# Altium project bailey-x.PrjPcb (part 2 of 8)
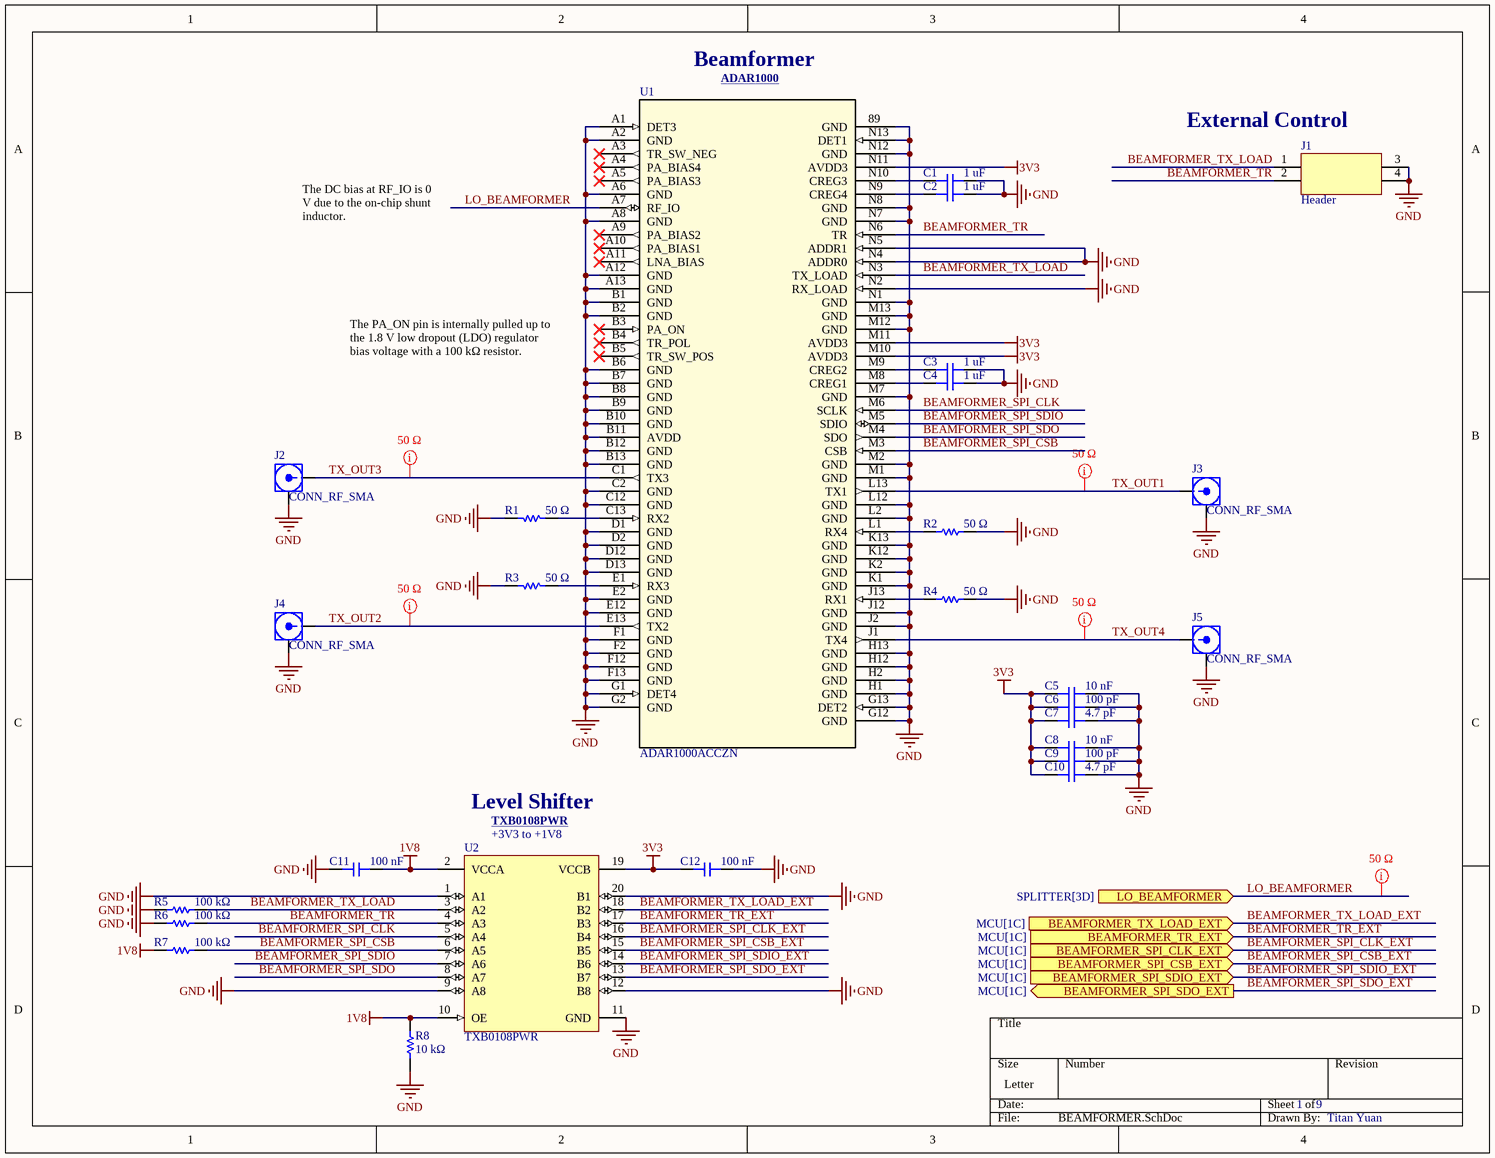
[diagram p9: BEAMFORMER.SchDoc]

## Sheet BEAMFORMER.SchDoc (continued)
### Library data of the parts
C1-C4 = CAP: 25V 1uF X7R ±10% 0603 Multilayer Ceramic Capacitors MLCC - SMD/SMT ROHS; Manufacturer: Samsung Electro-Mechanics; Manufacturer Part Number: CL10B105KA8NNNC; Tolerance: +-10%; Value: 1µF; Voltage Rating: 25 V; Dielectric: Ceramic; Package Size: 0603; Supplier: DigiKey; Supplier Part Number: 1276-1184-1-ND; RoHS: Compliant; Category: Ceramic Capacitors; Stock: 1060664; Pricing: 1=0.1, 10=0.036, 50=0.0244, 100=0.0208, 500=0.01486, 1000=0.01305 (USD); Case/Package: 0603; Case Code (Imperial): 0603; Case Code (Metric): 1608; China RoHS: Compliant; Contact Plating: Tin; Country of Origin: Mainland China, Philippines, South Korea; Depth: 800µm; Dielectric Material: Ceramic; Export Control Classification Number (ECCN) Code: EAR99; Height: 900µm; Harmonized Tariff Schedule (HTS) Code: 8532.24.00.20; Introduction Date: 2009-11-02; Length: 1.6mm; Lifecycle Status: Production; Material: Ceramic; Max Operating Temperature: 125°C; Min Operating Temperature: -55°C; Mounting Technology: Surface Mount; Number of Terminals: 2; Radiation Hardening: No; REACH SVHC: Yes; Schedule B: 8532240020, 8532240020|8532240020, 8532240020|8532240020|8532240020, 8532240020|8532240020|8532240020|8532240020; Thickness: 889µm; Voltage: 25V; Voltage Rating (DC): 25V; Width: 800µm; ComponentLink1URL: https://datasheet.octopart.com:443/CL10B105KA8NNNC-Samsung-Electro-Mechanics-datasheet-182019882.pdf?src-supplier=IHS; ComponentLink1Description: https://datasheet.octopart.com:443/CL10B105KA8NNNC-Samsung-Electro-Mechanics-datasheet-182019882.pdf?src-supplier=IHS; ComponentLink2URL: https://datasheet.octopart.com:443/CL10B105KA8NNNC-Samsung-Electro-Mechanics-datasheet-106547815.pdf?src-supplier=Upverter; ComponentLink2Description: https://datasheet.octopart.com:443/CL10B105KA8NNNC-Samsung-Electro-Mechanics-datasheet-106547815.pdf?src-supplier=Upverter; ComponentLink3URL: https://datasheet.octopart.com:443/CL10B105KA8NNNC-Samsung-Electro-Mechanics-datasheet-137699931.pdf?src-supplier=Samsung+SCT; ComponentLink3Description: https://datasheet.octopart.com:443/CL10B105KA8NNNC-Samsung-Electro-Mechanics-datasheet-137699931.pdf?src-supplier=Samsung+SCT; ComponentLink4URL: https://datasheet.octopart.com:443/CL10B105KA8NNNC-Samsung-Electro-Mechanics-datasheet-116890983.pdf?src-supplier=Future+Electronics; ComponentLink4Description: https://datasheet.octopart.com:443/CL10B105KA8NNNC-Samsung-Electro-Mechanics-datasheet-116890983.pdf?src-supplier=Future+Electronics; ComponentLink5URL: https://datasheet.octopart.com:443/CL10B105KA8NNNC-Samsung-datasheet-12527851.pdf?src-supplier=Future+Electronics; ComponentLink5Description: https://datasheet.octopart.com:443/CL10B105KA8NNNC-Samsung-datasheet-12527851.pdf?src-supplier=Future+Electronics; ComponentLink6URL: https://datasheet.octopart.com:443/CL10B105KA8NNNC-Samsung-datasheet-26669022.pdf?src-supplier=Future+Electronics; ComponentLink6Description: https://datasheet.octopart.com:443/CL10B105KA8NNNC-Samsung-datasheet-26669022.pdf?src-supplier=Future+Electronics; ComponentLink7URL: https://datasheet.octopart.com:443/CL10B105KA8NNNC-Samsung-Electro-Mechanics-datasheet-149136795.pdf?src-supplier=Future+Electronics; ComponentLink7Description: https://datasheet.octopart.com:443/CL10B105KA8NNNC-Samsung-Electro-Mechanics-datasheet-149136795.pdf?src-supplier=Future+Electronics; ComponentLink8URL: https://datasheet.octopart.com:443/CL10B105KA8NNNC-Samsung-datasheet-37081328.pdf?src-supplier=Future+Electronics; ComponentLink8Description: https://datasheet.octopart.com:443/CL10B105KA8NNNC-Samsung-datasheet-37081328.pdf?src-supplier=Future+Electronics; ComponentLink9URL: https://datasheet.octopart.com/CL10B105KA8NNNC-Samsung-Electro-Mechanics-datasheet-97040617.pdf; ComponentLink9Description: https://datasheet.octopart.com/CL10B105KA8NNNC-Samsung-Electro-Mechanics-datasheet-97040617.pdf; ComponentLink10URL: https://datasheet.octopart.com/CL10B105KA8NNNC-Samsung-Electro-Mechanics-datasheet-8324245.pdf; ComponentLink10Description: https://datasheet.octopart.com/CL10B105KA8NNNC-Samsung-Electro-Mechanics-datasheet-8324245.pdf; ComponentLink11URL: https://datasheet.octopart.com:443/CL10B105KA8NNNC-Samsung-datasheet-59220082.pdf?src-supplier=TME; ComponentLink11Description: https://datasheet.octopart.com:443/CL10B105KA8NNNC-Samsung-datasheet-59220082.pdf?src-supplier=TME; ComponentLink12URL: https://datasheet.octopart.com:443/CL10B105KA8NNNC-Samsung-Electro-Mechanics-datasheet-11897796.pdf?src-supplier=Arrow+Electronics; ComponentLink12Description: https://datasheet.octopart.com:443/CL10B105KA8NNNC-Samsung-Electro-Mechanics-datasheet-11897796.pdf?src-supplier=Arrow+Electronics
C5 C8 = CAP: Multilayer Ceramic Capacitor, 0.01 uF, 25 V, ± 10%, X7R, 0402 [1005 Metric]; Manufacturer: Murata Electronics; Manufacturer Part Number: GRM155R71E103KA01D; Manufacturer Lifecycle Status: NRND; Tolerance: +-10%; Voltage Rating: 25 V; Value: 10nF; Insulation Resistance: 10GΩ; Voltage: 25V; Dielectric: Ceramic; Package Size: 0402; Supplier: DigiKey; Supplier Part Number: 490-1312-1-ND; RoHS: Compliant; Category: Ceramic Capacitors; Stock: 5215934; Pricing: 1=0.1, 10=0.021, 50=0.014, 100=0.0118, 500=0.00822, 1000=0.00713, 2500=0.00598, 5000=0.00529, 10000=0.0046, 20000=0.00415, 30000=0.00392, 50000=0.00367, 70000=0.00353, 100000=0.00339 (USD); Case/Package: 0402; Case Code (Imperial): 0402; Case Code (Metric): 1005; Country of Origin: Japan, Mainland China, Philippines, Singapore, Thailand; Depth: 500µm; Dielectric Material: Ceramic; Export Control Classification Number (ECCN) Code: EAR99; Height: 500µm; Harmonized Tariff Schedule (HTS) Code: 8532.24.00.20; Introduction Date: 2004-11-19; Lead Free: Lead Free; Length: 1mm; Lifecycle Status: NRND; Material: Ceramic; Max Operating Temperature: 125°C; Min Operating Temperature: -55°C; Mounting Technology: Surface Mount; Pins: 2; Number of Terminals: 2; Radiation Hardening: No; REACH SVHC: Yes; Schedule B: 8532240020, 8532240020|8532240020, 8532240020|8532240020|8532240020, 8532240020|8532240020|8532240020|8532240020; Termination: SMD/SMT; Thickness: 500µm; Voltage Rating (DC): 25V; Width: 500µm; ComponentLink1URL: https://datasheet.octopart.com:443/GRM155R71E103KA01D-Murata-datasheet-501912.pdf?src-supplier=Upverter; ComponentLink1Description: https://datasheet.octopart.com:443/GRM155R71E103KA01D-Murata-datasheet-501912.pdf?src-supplier=Upverter; ComponentLink2URL: https://datasheet.octopart.com:443/GRM155R71E103KA01D-Murata-datasheet-8326352.pdf?src-supplier=element14+APAC; ComponentLink2Description: https://datasheet.octopart.com:443/GRM155R71E103KA01D-Murata-datasheet-8326352.pdf?src-supplier=element14+APAC; ComponentLink3URL: https://datasheet.octopart.com:443/GRM155R71E103KA01D-Murata-datasheet-62320227.pdf?src-supplier=element14+APAC; ComponentLink3Description: https://datasheet.octopart.com:443/GRM155R71E103KA01D-Murata-datasheet-62320227.pdf?src-supplier=element14+APAC; ComponentLink4URL: https://datasheet.octopart.com:443/GRM155R71E103KA01D-Murata-datasheet-12548432.pdf?src-supplier=_legacy+Avnet; ComponentLink4Description: https://datasheet.octopart.com:443/GRM155R71E103KA01D-Murata-datasheet-12548432.pdf?src-supplier=_legacy+Avnet; ComponentLink5URL: https://datasheet.octopart.com:443/GRM155R71E103KA01D-Murata-datasheet-14396901.pdf?src-supplier=Future+Electronics; ComponentLink5Description: https://datasheet.octopart.com:443/GRM155R71E103KA01D-Murata-datasheet-14396901.pdf?src-supplier=Future+Electronics; ComponentLink6URL: https://datasheet.octopart.com:443/GRM155R71E103KA01D-Murata-datasheet-22122223.pdf?src-supplier=Future+Electronics; ComponentLink6Description: https://datasheet.octopart.com:443/GRM155R71E103KA01D-Murata-datasheet-22122223.pdf?src-supplier=Future+Electronics; ComponentLink7URL: https://datasheet.octopart.com:443/GRM155R71E103KA01D-Murata-datasheet-44106405.pdf?src-supplier=Future+Electronics; ComponentLink7Description: https://datasheet.octopart.com:443/GRM155R71E103KA01D-Murata-datasheet-44106405.pdf?src-supplier=Future+Electronics; ComponentLink8URL: https://datasheet.octopart.com:443/GRM155R71E103KA01D-Murata-datasheet-165579666.pdf?src-supplier=TME; ComponentLink8Description: https://datasheet.octopart.com:443/GRM155R71E103KA01D-Murata-datasheet-165579666.pdf?src-supplier=TME; ComponentLink9URL: https://datasheet.octopart.com:443/GRM155R71E103KA01D-Murata-datasheet-59876780.pdf?src-supplier=TME; ComponentLink9Description: https://datasheet.octopart.com:443/GRM155R71E103KA01D-Murata-datasheet-59876780.pdf?src-supplier=TME; ComponentLink10URL: https://datasheet.octopart.com:443/GRM155R71E103KA01D-Murata-datasheet-141266224.pdf?src-supplier=Ciiva; ComponentLink10Description: https://datasheet.octopart.com:443/GRM155R71E103KA01D-Murata-datasheet-141266224.pdf?src-supplier=Ciiva; ComponentLink11URL: https://datasheet.octopart.com:443/GRM155R71E103KA01D-Murata-datasheet-140691364.pdf?src-supplier=Ciiva; ComponentLink11Description: https://datasheet.octopart.com:443/GRM155R71E103KA01D-Murata-datasheet-140691364.pdf?src-supplier=Ciiva; ComponentLink12URL: https://datasheet.octopart.com:443/GRM155R71E103KA01D-Murata-datasheet-138740934.pdf?src-supplier=Ciiva; ComponentLink12Description: https://datasheet.octopart.com:443/GRM155R71E103KA01D-Murata-datasheet-138740934.pdf?src-supplier=Ciiva; ComponentLink13URL: https://datasheet.octopart.com:443/GRM155R71E103KA01D-Murata-datasheet-120101189.pdf?src-supplier=Megastar; ComponentLink13Description: https://datasheet.octopart.com:443/GRM155R71E103KA01D-Murata-datasheet-120101189.pdf?src-supplier=Megastar; ComponentLink14URL: https://datasheet.octopart.com/GRM155R71E103KA01D-Murata-datasheet-12515295.pdf; ComponentLink14Description: https://datasheet.octopart.com/GRM155R71E103KA01D-Murata-datasheet-12515295.pdf; ComponentLink15URL: https://datasheet.octopart.com/GRM155R71E103KA01D-Murata-datasheet-12510076.pdf; ComponentLink15Description: https://datasheet.octopart.com/GRM155R71E103KA01D-Murata-datasheet-12510076.pdf; ComponentLink16URL: https://datasheet.octopart.com/GRM155R71E103KA01D-Murata-datasheet-11978611.pdf; ComponentLink16Description: https://datasheet.octopart.com/GRM155R71E103KA01D-Murata-datasheet-11978611.pdf; ComponentLink17URL: https://datasheet.octopart.com/GRM155R71E103KA01D-Murata-datasheet-10025737.pdf; ComponentLink17Description: https://datasheet.octopart.com/GRM155R71E103KA01D-Murata-datasheet-10025737.pdf; ComponentLink18URL: https://datasheet.octopart.com/GRM155R71E103KA01D-Murata-datasheet-8819587.pdf; ComponentLink18Description: https://datasheet.octopart.com/GRM155R71E103KA01D-Murata-datasheet-8819587.pdf; ComponentLink19URL: https://datasheet.octopart.com:443/GRM155R71E103KA01D-Murata-datasheet-632409.pdf?src-supplier=Farnell; ComponentLink19Description: https://datasheet.octopart.com:443/GRM155R71E103KA01D-Murata-datasheet-632409.pdf?src-supplier=Farnell; ComponentLink20URL: https://datasheet.octopart.com:443/GRM155R71E103KA01D-Murata-datasheet-514334.pdf?src-supplier=Farnell; ComponentLink20Description: https://datasheet.octopart.com:443/GRM155R71E103KA01D-Murata-datasheet-514334.pdf?src-supplier=Farnell; ComponentLink21URL: https://datasheet.octopart.com:443/GRM155R71E103KA01D-Murata-datasheet-148211.pdf?src-supplier=Garrett; ComponentLink21Description: https://datasheet.octopart.com:443/GRM155R71E103KA01D-Murata-datasheet-148211.pdf?src-supplier=Garrett; ComponentLink22URL: https://datasheet.octopart.com:443/GRM155R71E103KA01D-Murata-datasheet-102.pdf?src-supplier=DigiKey; ComponentLink22Description: https://datasheet.octopart.com:443/GRM155R71E103KA01D-Murata-datasheet-102.pdf?src-supplier=DigiKey; ComponentLink23URL: http://sigma.octopart.com:80/reach_statement/Murata-company-16.pdf?src-supplier=Compliance+Statements; ComponentLink23Description: http://sigma.octopart.com:80/reach_statement/Murata-company-16.pdf?src-supplier=Compliance+Statements
C6 C9 = CAP: 50V 100pF NP0 ±5% 0402 Multilayer Ceramic Capacitors MLCC - SMD/SMT ROHS; Manufacturer: Yageo; Manufacturer Part Number: CC0402JRNPO9BN101; Tolerance: +-5%; Insulation Resistance: 100GΩ; Temperature Coefficient: 30ppm/°C; Voltage Rating: 50 V; Dielectric: Ceramic; Package Size: 0402; Supplier: DigiKey; Supplier Part Number: 311-1024-1-ND; RoHS: Compliant; Category: Ceramic Capacitors; Stock: 3080901; Pricing: 1=0.08, 10=0.003, 10000=0.0032, 20000=0.0031, 30000=0.00304, 50000=0.00283, 70000=0.00282 (USD); Value: 100pF; Case/Package: 0402; Case Code (Imperial): 0402; Case Code (Metric): 1005; China RoHS: Compliant; Composition: Ceramic; Depth: 500µm; Dielectric Material: Ceramic; Halogen Free: Halogen Free; Height: 500µm; Lead Free: Lead Free; Length: 1mm; Lifecycle Status: Production; Max Operating Temperature: 125°C; Min Operating Temperature: -55°C; Mounting Technology: Surface Mount; Pins: 2; Number of Terminals: 2; Radiation Hardening: No; REACH SVHC: Yes; Schedule B: 8532240020, 8532240020|8532240020|8532240020|8532240020|8532240020|8532240020|8532240020|8532240020|8532240020|8532240020|8532240020|8532240020|8532240020|8532240020|8532240020|8532240020|8532240020|8532240020|8532240020|8532240020|8532240020|8532240020|8532240020|85; Termination: SMD/SMT; Thickness: 558.8µm; Voltage: 50V; Voltage Rating (AC): 50V; Voltage Rating (DC): 50V; Width: 500µm; ComponentLink1URL: https://datasheet.octopart.com:443/CC0402JRNPO9BN101-Yageo-datasheet-182140217.pdf?src-supplier=IHS; ComponentLink1Description: https://datasheet.octopart.com:443/CC0402JRNPO9BN101-Yageo-datasheet-182140217.pdf?src-supplier=IHS; ComponentLink2URL: https://datasheet.octopart.com:443/CC0402JRNPO9BN101-Yageo-datasheet-10406438.pdf?src-supplier=element14+APAC; ComponentLink2Description: https://datasheet.octopart.com:443/CC0402JRNPO9BN101-Yageo-datasheet-10406438.pdf?src-supplier=element14+APAC; ComponentLink3URL: https://datasheet.octopart.com:443/CC0402JRNPO9BN101-Yageo-datasheet-151948684.pdf?src-supplier=element14+APAC; ComponentLink3Description: https://datasheet.octopart.com:443/CC0402JRNPO9BN101-Yageo-datasheet-151948684.pdf?src-supplier=element14+APAC; ComponentLink4URL: https://datasheet.octopart.com:443/CC0402JRNPO9BN101-Yageo-datasheet-67645495.pdf?src-supplier=element14+APAC; ComponentLink4Description: https://datasheet.octopart.com:443/CC0402JRNPO9BN101-Yageo-datasheet-67645495.pdf?src-supplier=element14+APAC; ComponentLink5URL: https://datasheet.octopart.com:443/CC0402JRNPO9BN101-Yageo-datasheet-10882999.pdf?src-supplier=element14+APAC; ComponentLink5Description: https://datasheet.octopart.com:443/CC0402JRNPO9BN101-Yageo-datasheet-10882999.pdf?src-supplier=element14+APAC; ComponentLink6URL: https://datasheet.octopart.com:443/CC0402JRNPO9BN101-Yageo-datasheet-78855684.pdf?src-supplier=Upverter; ComponentLink6Description: https://datasheet.octopart.com:443/CC0402JRNPO9BN101-Yageo-datasheet-78855684.pdf?src-supplier=Upverter; ComponentLink7URL: https://datasheet.octopart.com:443/CC0402JRNPO9BN101-Yageo-Group-datasheet-188689597.pdf?src-supplier=Farnell; ComponentLink7Description: https://datasheet.octopart.com:443/CC0402JRNPO9BN101-Yageo-Group-datasheet-188689597.pdf?src-supplier=Farnell; ComponentLink8URL: https://datasheet.octopart.com:443/CC0402JRNPO9BN101-Yageo-datasheet-10621397.pdf?src-supplier=Farnell; ComponentLink8Description: https://datasheet.octopart.com:443/CC0402JRNPO9BN101-Yageo-datasheet-10621397.pdf?src-supplier=Farnell; ComponentLink9URL: https://datasheet.octopart.com:443/CC0402JRNPO9BN101-Yageo-datasheet-65873193.pdf?src-supplier=Newark; ComponentLink9Description: https://datasheet.octopart.com:443/CC0402JRNPO9BN101-Yageo-datasheet-65873193.pdf?src-supplier=Newark; ComponentLink10URL: https://datasheet.octopart.com:443/CC0402JRNPO9BN101-Yageo-datasheet-5301394.pdf?src-supplier=Newark; ComponentLink10Description: https://datasheet.octopart.com:443/CC0402JRNPO9BN101-Yageo-datasheet-5301394.pdf?src-supplier=Newark; ComponentLink11URL: https://datasheet.octopart.com:443/CC0402JRNPO9BN101-Yageo-datasheet-182966517.pdf?src-supplier=Newark; ComponentLink11Description: https://datasheet.octopart.com:443/CC0402JRNPO9BN101-Yageo-datasheet-182966517.pdf?src-supplier=Newark; ComponentLink12URL: https://datasheet.octopart.com:443/CC0402JRNPO9BN101-Yageo-datasheet-137875056.pdf?src-supplier=Future+Electronics; ComponentLink12Description: https://datasheet.octopart.com:443/CC0402JRNPO9BN101-Yageo-datasheet-137875056.pdf?src-supplier=Future+Electronics; ComponentLink13URL: https://datasheet.octopart.com:443/CC0402JRNPO9BN101-Yageo-datasheet-136957424.pdf?src-supplier=Future+Electronics; ComponentLink13Description: https://datasheet.octopart.com:443/CC0402JRNPO9BN101-Yageo-datasheet-136957424.pdf?src-supplier=Future+Electronics; ComponentLink14URL: https://datasheet.octopart.com:443/CC0402JRNPO9BN101-Yageo-datasheet-137700082.pdf?src-supplier=Future+Electronics; ComponentLink14Description: https://datasheet.octopart.com:443/CC0402JRNPO9BN101-Yageo-datasheet-137700082.pdf?src-supplier=Future+Electronics; ComponentLink15URL: https://datasheet.octopart.com:443/CC0402JRNPO9BN101-Yageo-datasheet-62126864.pdf?src-supplier=Future+Electronics; ComponentLink15Description: https://datasheet.octopart.com:443/CC0402JRNPO9BN101-Yageo-datasheet-62126864.pdf?src-supplier=Future+Electronics; ComponentLink16URL: https://datasheet.octopart.com:443/CC0402JRNPO9BN101-Yageo-datasheet-62091628.pdf?src-supplier=Future+Electronics; ComponentLink16Description: https://datasheet.octopart.com:443/CC0402JRNPO9BN101-Yageo-datasheet-62091628.pdf?src-supplier=Future+Electronics; ComponentLink17URL: https://datasheet.octopart.com:443/CC0402JRNPO9BN101-Yageo-datasheet-24578986.pdf?src-supplier=Future+Electronics; ComponentLink17Description: https://datasheet.octopart.com:443/CC0402JRNPO9BN101-Yageo-datasheet-24578986.pdf?src-supplier=Future+Electronics; ComponentLink18URL: https://datasheet.octopart.com:443/CC0402JRNPO9BN101-Yageo-datasheet-16730043.pdf?src-supplier=Future+Electronics; ComponentLink18Description: https://datasheet.octopart.com:443/CC0402JRNPO9BN101-Yageo-datasheet-16730043.pdf?src-supplier=Future+Electronics; ComponentLink19URL: https://datasheet.octopart.com:443/CC0402JRNPO9BN101-Yageo-datasheet-12589826.pdf?src-supplier=Future+Electronics; ComponentLink19Description: https://datasheet.octopart.com:443/CC0402JRNPO9BN101-Yageo-datasheet-12589826.pdf?src-supplier=Future+Electronics; ComponentLink20URL: https://datasheet.octopart.com:443/CC0402JRNPO9BN101-Yageo-datasheet-8817079.pdf?src-supplier=element14; ComponentLink20Description: https://datasheet.octopart.com:443/CC0402JRNPO9BN101-Yageo-datasheet-8817079.pdf?src-supplier=element14; ComponentLink21URL: https://datasheet.octopart.com:443/CC0402JRNPO9BN101-Yageo-datasheet-8324240.pdf?src-supplier=element14; ComponentLink21Description: https://datasheet.octopart.com:443/CC0402JRNPO9BN101-Yageo-datasheet-8324240.pdf?src-supplier=element14; ComponentLink22URL: https://datasheet.octopart.com:443/CC0402JRNPO9BN101-Yageo-datasheet-504625.pdf?src-supplier=element14; ComponentLink22Description: https://datasheet.octopart.com:443/CC0402JRNPO9BN101-Yageo-datasheet-504625.pdf?src-supplier=element14; ComponentLink23URL: https://datasheet.octopart.com:443/CC0402JRNPO9BN101-Yageo-datasheet-5321569.pdf?src-supplier=element14; ComponentLink23Description: https://datasheet.octopart.com:443/CC0402JRNPO9BN101-Yageo-datasheet-5321569.pdf?src-supplier=element14; ComponentLink24URL: https://datasheet.octopart.com:443/CC0402JRNPO9BN101-Yageo-datasheet-68296204.pdf?src-supplier=Megastar; ComponentLink24Description: https://datasheet.octopart.com:443/CC0402JRNPO9BN101-Yageo-datasheet-68296204.pdf?src-supplier=Megastar; ComponentLink25URL: http://sigma.octopart.com:80/conflict_mineral_statement/Yageo-company-3.pdf?src-supplier=Compliance+Statements; ComponentLink25Description: http://sigma.octopart.com:80/conflict_mineral_statement/Yageo-company-3.pdf?src-supplier=Compliance+Statements; ComponentLink26URL: http://sigma.octopart.com:80/rohs_statement/Yageo-company-2.pdf?src-supplier=Compliance+Statements; ComponentLink26Description: http://sigma.octopart.com:80/rohs_statement/Yageo-company-2.pdf?src-supplier=Compliance+Statements
C7 C10 = CAP: 0402 4.7 pF 50 V ±0.25 pF Tolerance C0G SMT Multilayer Ceramic Capacitor; Manufacturer: Murata Electronics; Manufacturer Part Number: GRM1555C1H4R7CA01D; Manufacturer Lifecycle Status: NRND; Tolerance: +-0.25 pF; Voltage Rating: 50 V; Value: 4.7pF; Temperature Coefficient: 30ppm/°C; Voltage: 50V; Dielectric: Ceramic; Package Size: 0402; Supplier: DigiKey; Supplier Part Number: 490-5874-1-ND; RoHS: Compliant; Category: Ceramic Capacitors; Stock: 1474189; Pricing: 1=0.1, 10=0.022, 50=0.0146, 100=0.0123, 500=0.00858, 1000=0.00744, 2500=0.00625, 5000=0.00554 (USD); Case/Package: 0402; Case Code (Imperial): 0402; Case Code (Metric): 1005; Depth: 500µm; Dielectric Material: Ceramic; Export Control Classification Number (ECCN) Code: EAR99; Height: 500µm; Harmonized Tariff Schedule (HTS) Code: 8532.24.00.20; Introduction Date: 2008-09-01; Lead Free: Lead Free; Length: 1mm; Lifecycle Status: NRND; Material: Ceramic; Max Operating Temperature: 125°C; Min Operating Temperature: -55°C; Mounting Technology: Surface Mount; Number of Terminals: 2; Packaging: Cut Tape; Radiation Hardening: No; REACH SVHC: Yes; Schedule B: 8532240020, 8532240020|8532240020, 8532240020|8532240020|8532240020, 8532240020|8532240020|8532240020|8532240020; Termination: SMD/SMT; Thickness: 500µm; Voltage Rating (DC): 50V; Width: 500µm; ComponentLink1URL: https://datasheet.octopart.com:443/GRM1555C1H4R7CA01D-Murata-datasheet-62317075.pdf?src-supplier=element14+APAC; ComponentLink1Description: https://datasheet.octopart.com:443/GRM1555C1H4R7CA01D-Murata-datasheet-62317075.pdf?src-supplier=element14+APAC; ComponentLink2URL: https://datasheet.octopart.com/GRM1555C1H4R7CA01D-Murata-datasheet-12547556.pdf; ComponentLink2Description: https://datasheet.octopart.com/GRM1555C1H4R7CA01D-Murata-datasheet-12547556.pdf; ComponentLink3URL: https://datasheet.octopart.com/GRM1555C1H4R7CA01D-Murata-datasheet-12515295.pdf; ComponentLink3Description: https://datasheet.octopart.com/GRM1555C1H4R7CA01D-Murata-datasheet-12515295.pdf; ComponentLink4URL: https://datasheet.octopart.com/GRM1555C1H4R7CA01D-Murata-datasheet-12510076.pdf; ComponentLink4Description: https://datasheet.octopart.com/GRM1555C1H4R7CA01D-Murata-datasheet-12510076.pdf; ComponentLink5URL: https://datasheet.octopart.com/GRM1555C1H4R7CA01D-Murata-datasheet-11978611.pdf; ComponentLink5Description: https://datasheet.octopart.com/GRM1555C1H4R7CA01D-Murata-datasheet-11978611.pdf; ComponentLink6URL: https://datasheet.octopart.com/GRM1555C1H4R7CA01D-Murata-datasheet-10025737.pdf; ComponentLink6Description: https://datasheet.octopart.com/GRM1555C1H4R7CA01D-Murata-datasheet-10025737.pdf; ComponentLink7URL: https://datasheet.octopart.com/GRM1555C1H4R7CA01D-Murata-datasheet-8819587.pdf; ComponentLink7Description: https://datasheet.octopart.com/GRM1555C1H4R7CA01D-Murata-datasheet-8819587.pdf; ComponentLink8URL: https://datasheet.octopart.com:443/GRM1555C1H4R7CA01D-Murata-datasheet-141274223.pdf?src-supplier=Ciiva; ComponentLink8Description: https://datasheet.octopart.com:443/GRM1555C1H4R7CA01D-Murata-datasheet-141274223.pdf?src-supplier=Ciiva; ComponentLink9URL: https://datasheet.octopart.com:443/GRM1555C1H4R7CA01D-Murata-datasheet-140682516.pdf?src-supplier=Ciiva; ComponentLink9Description: https://datasheet.octopart.com:443/GRM1555C1H4R7CA01D-Murata-datasheet-140682516.pdf?src-supplier=Ciiva; ComponentLink10URL: https://datasheet.octopart.com:443/GRM1555C1H4R7CA01D-Murata-datasheet-138739644.pdf?src-supplier=Ciiva; ComponentLink10Description: https://datasheet.octopart.com:443/GRM1555C1H4R7CA01D-Murata-datasheet-138739644.pdf?src-supplier=Ciiva; ComponentLink11URL: https://datasheet.octopart.com:443/GRM1555C1H4R7CA01D-Murata-datasheet-81455562.pdf?src-supplier=TME; ComponentLink11Description: https://datasheet.octopart.com:443/GRM1555C1H4R7CA01D-Murata-datasheet-81455562.pdf?src-supplier=TME; ComponentLink12URL: https://datasheet.octopart.com:443/GRM1555C1H4R7CA01D-Murata-datasheet-22122223.pdf?src-supplier=Future+Electronics; ComponentLink12Description: https://datasheet.octopart.com:443/GRM1555C1H4R7CA01D-Murata-datasheet-22122223.pdf?src-supplier=Future+Electronics; ComponentLink13URL: https://datasheet.octopart.com:443/GRM1555C1H4R7CA01D-Murata-datasheet-11631916.pdf?src-supplier=Arrow+Electronics; ComponentLink13Description: https://datasheet.octopart.com:443/GRM1555C1H4R7CA01D-Murata-datasheet-11631916.pdf?src-supplier=Arrow+Electronics; ComponentLink14URL: http://sigma.octopart.com:80/reach_statement/Murata-company-16.pdf?src-supplier=Compliance+Statements; ComponentLink14Description: http://sigma.octopart.com:80/reach_statement/Murata-company-16.pdf?src-supplier=Compliance+Statements
C11 C12 = CAP: Ceramic Capacitor, Ceramic, 50V, 10% +Tol, 10% -Tol, X7R, 15% TC, 0.1uF, Surface Mount, 0402; Manufacturer: Yageo; Manufacturer Part Number: CC0402KPX7R9BB104; Tolerance: +-10%; Value: 100nF; Voltage Rating: 50 V; Dielectric: Ceramic; Package Size: 0402; Supplier: DigiKey; Supplier Part Number: 13-CC0402KPX7R9BB104CT-ND; RoHS: Compliant; Category: Ceramic Capacitors; Stock: 40680; Pricing: 1=0.1, 10=0.053, 50=0.0364, 100=0.0313, 500=0.02292, 1000=0.02035, 2500=0.01764, 5000=0.01601 (USD); Case/Package: 0402; China RoHS: Compliant; Dielectric Material: Ceramic; Height: 500µm; Lead Free: Lead Free; Length: 1mm; Lifecycle Status: Production; Max Operating Temperature: 125°C; Min Operating Temperature: -55°C; Mounting Technology: Surface Mount; Number of Terminals: 2; REACH SVHC: Yes; Voltage Rating (DC): 50V; Width: 500µm; ComponentLink1URL: https://datasheet.octopart.com:443/CC0402KPX7R9BB104-Yageo-datasheet-177165144.pdf?src-supplier=IHS; ComponentLink1Description: https://datasheet.octopart.com:443/CC0402KPX7R9BB104-Yageo-datasheet-177165144.pdf?src-supplier=IHS; ComponentLink2URL: https://datasheet.octopart.com:443/CC0402KPX7R9BB104-Yageo-Group-datasheet-189192896.pdf?src-supplier=Future+Electronics; ComponentLink2Description: https://datasheet.octopart.com:443/CC0402KPX7R9BB104-Yageo-Group-datasheet-189192896.pdf?src-supplier=Future+Electronics; ComponentLink3URL: https://datasheet.octopart.com:443/CC0402KPX7R9BB104-Yageo-datasheet-181967134.pdf?src-supplier=Farnell; ComponentLink3Description: https://datasheet.octopart.com:443/CC0402KPX7R9BB104-Yageo-datasheet-181967134.pdf?src-supplier=Farnell; ComponentLink4URL: https://datasheet.octopart.com/Surface-Mount-Ceramic-Multilayer-Capacitors%3B-General-Purpose-%26-High-Capacitance-Class-2%2C-X7R-Yageo-datasheet-family-114.pdf; ComponentLink4Description: https://datasheet.octopart.com/Surface-Mount-Ceramic-Multilayer-Capacitors%3B-General-Purpose-%26-High-Capacitance-Class-2%2C-X7R-Yageo-datasheet-family-114.pdf; ComponentLink5URL: https://datasheet.octopart.com/CC0402KPX7R9BB104-Yageo-datasheet-10883670.pdf; ComponentLink5Description: https://datasheet.octopart.com/CC0402KPX7R9BB104-Yageo-datasheet-10883670.pdf; ComponentLink6URL: http://sigma.octopart.com:80/rohs_statement/Surface-Mount-Ceramic-Multilayer-Capacitors%3B-General-Purpose-%26-High-Capacitance-Class-2%2C-X7R-Yageo-family-124.pdf?src-supplier=Compliance+Statements; ComponentLink6Description: http://sigma.octopart.com:80/rohs_statement/Surface-Mount-Ceramic-Multilayer-Capacitors%3B-General-Purpose-%26-High-Capacitance-Class-2%2C-X7R-Yageo-family-124.pdf?src-supplier=Compliance+Statements; ComponentLink7URL: http://sigma.octopart.com:80/reach_statement/Surface-Mount-Ceramic-Multilayer-Capacitors%3B-General-Purpose-%26-High-Capacitance-Class-2%2C-X7R-Yageo-family-125.pdf?src-supplier=Compliance+Statements; ComponentLink7Description: http://sigma.octopart.com:80/reach_statement/Surface-Mount-Ceramic-Multilayer-Capacitors%3B-General-Purpose-%26-High-Capacitance-Class-2%2C-X7R-Yageo-family-125.pdf?src-supplier=Compliance+Statements; ComponentLink8URL: http://sigma.octopart.com:80/conflict_mineral_statement/Yageo-company-3.pdf?src-supplier=Compliance+Statements; ComponentLink8Description: http://sigma.octopart.com:80/conflict_mineral_statement/Yageo-company-3.pdf?src-supplier=Compliance+Statements; ComponentLink9URL: http://sigma.octopart.com:80/rohs_statement/Yageo-company-2.pdf?src-supplier=Compliance+Statements; ComponentLink9Description: http://sigma.octopart.com:80/rohs_statement/Yageo-company-2.pdf?src-supplier=Compliance+Statements
J1 = CONN_2x2_2.54mm_PinHeader_Vertical: Pin Header, Board-to-Board, 2.54 mm, 2 Rows, 4 Contacts, Through Hole, TSW Series; Manufacturer: Samtec; Manufacturer Part Number: TSW-102-07-F-D; Manufacturer Lifecycle Status: PRODUCTION; Connector Type: Male Pin; Gender: Male; Max Current Rating: 7.6A; Max Voltage Rating (AC): 550V; Number of Contacts: 4; Pitch: 2.54mm; Supplier: DigiKey; Supplier Part Number: SAM10843-ND; RoHS: Compliant; Category: Headers and Wire Housings; Stock: 11283; Pricing: 1=0.22, 50=0.19, 100=0.16, 500=0.14, 1000=0.11, 2000=0.1, 5000=0.09, 10000=0.08206 (USD); Color: Black; Contact Material: Bronze; Contact Mating Length: 5.842mm; Contact Plating: Gold; Depth: 5.08mm; Housing Color: Black; Housing Material: Polyester; Lead Pitch: 2.54mm; Length: 5.08mm; Lifecycle Status: Production; Max Operating Temperature: 125°C; Min Operating Temperature: -55°C; Mounting Technology: Through Hole; Number of Positions: 4; Number of Rows: 2; Orientation: Straight; Radiation Hardening: No; REACH SVHC: No; Row Spacing: 2.54mm; Termination: Solder; ComponentLink1URL: https://datasheet.octopart.com:443/TSW-102-07-F-D-Samtec-datasheet-97325576.pdf?src-supplier=Sager+Electronics; ComponentLink1Description: https://datasheet.octopart.com:443/TSW-102-07-F-D-Samtec-datasheet-97325576.pdf?src-supplier=Sager+Electronics; ComponentLink2URL: https://datasheet.octopart.com:443/TSW-102-07-F-D-Samtec-datasheet-151455181.pdf?src-supplier=Sager+Electronics; ComponentLink2Description: https://datasheet.octopart.com:443/TSW-102-07-F-D-Samtec-datasheet-151455181.pdf?src-supplier=Sager+Electronics; ComponentLink3URL: https://sigma.octopart.com:443/97325577/technical_drawing/Samtec-TSW-102-07-F-D.pdf?src-supplier=HQonline; ComponentLink3Description: https://sigma.octopart.com:443/97325577/technical_drawing/Samtec-TSW-102-07-F-D.pdf?src-supplier=HQonline; ComponentLink4URL: https://datasheet.octopart.com:443/TSW-102-07-F-D-Samtec-datasheet-62107121.pdf?src-supplier=Farnell; ComponentLink4Description: https://datasheet.octopart.com:443/TSW-102-07-F-D-Samtec-datasheet-62107121.pdf?src-supplier=Farnell; ComponentLink5URL: https://datasheet.octopart.com:443/TSW-102-07-F-D-Samtec-datasheet-136646178.pdf?src-supplier=Master+Electronics; ComponentLink5Description: https://datasheet.octopart.com:443/TSW-102-07-F-D-Samtec-datasheet-136646178.pdf?src-supplier=Master+Electronics; ComponentLink6URL: https://datasheet.octopart.com:443/TSW-102-07-F-D-Samtec-datasheet-118235302.pdf?src-supplier=Electro+Sonic; ComponentLink6Description: https://datasheet.octopart.com:443/TSW-102-07-F-D-Samtec-datasheet-118235302.pdf?src-supplier=Electro+Sonic; ComponentLink7URL: https://datasheet.octopart.com:443/TSW-102-07-F-D-Samtec-datasheet-180258786.pdf?src-supplier=JRH+Electronics; ComponentLink7Description: https://datasheet.octopart.com:443/TSW-102-07-F-D-Samtec-datasheet-180258786.pdf?src-supplier=JRH+Electronics; ComponentLink8URL: https://datasheet.octopart.com:443/TSW-102-07-F-D-Samtec-datasheet-160657603.pdf?src-supplier=Toby+Electronics; ComponentLink8Description: https://datasheet.octopart.com:443/TSW-102-07-F-D-Samtec-datasheet-160657603.pdf?src-supplier=Toby+Electronics; ComponentLink9URL: https://datasheet.octopart.com:443/TSW-102-07-F-D-Samtec-datasheet-116539033.pdf?src-supplier=Toby+Electronics; ComponentLink9Description: https://datasheet.octopart.com:443/TSW-102-07-F-D-Samtec-datasheet-116539033.pdf?src-supplier=Toby+Electronics; ComponentLink10URL: https://datasheet.octopart.com:443/TSW-102-07-F-D-Samtec-datasheet-116536310.pdf?src-supplier=Toby+Electronics; ComponentLink10Description: https://datasheet.octopart.com:443/TSW-102-07-F-D-Samtec-datasheet-116536310.pdf?src-supplier=Toby+Electronics; ComponentLink11URL: https://datasheet.octopart.com/TSW-102-07-F-D-Samtec-datasheet-86818365.pdf; ComponentLink11Description: https://datasheet.octopart.com/TSW-102-07-F-D-Samtec-datasheet-86818365.pdf; ComponentLink12URL: https://datasheet.octopart.com:443/TSW-102-07-F-D-Samtec-datasheet-11047283.pdf?src-supplier=Newark; ComponentLink12Description: https://datasheet.octopart.com:443/TSW-102-07-F-D-Samtec-datasheet-11047283.pdf?src-supplier=Newark
J2-J5 = CONN_RF_SMA: RF / Coaxial Connector, SMA Coaxial, Straight Jack, Solder, 50 ohm, Beryllium Copper; Manufacturer: Cinch Connectivity Solutions Johnson; Maximum Frequency: 18 GHz; Body Material: Brass; Body Plating: Gold; Connector Type: Coaxial, PCB, SMA, Socket; Contact Resistance: 4mΩ; Dielectric Material: PTFE; Frequency: 18GHz; Gender: Female; Impedance: 50Ω; Insulation Resistance: 5GΩ; Number of Contacts: 1; Polarity: Normal; Voltage Rating: 335V; Manufacturer Part Number: 142-0701-801; Supplier: DigiKey; Supplier Part Number: J502-ND; RoHS: Compliant; Category: RF / Coaxial Connectors; Stock: 35108; Pricing: 1=3.73, 10=3.166, 25=2.9676, 50=2.826, 100=2.691, 250=2.52244, 500=2.40206, 1000=2.28748, 2500=2.1444 (USD); Case/Package: SMA; Contact Gender: Female; Contact Material: Gold, Nickel; Contact Plating: Gold; Depth: 25.58mm; Export Control Classification Number (ECCN) Code: EAR99; Fastening Type: Threaded; Height: 9.779mm; Housing Color: Gold; Housing Material: Brass; Harmonized Tariff Schedule (HTS) Code: 8536.69.40.10; Insulation Material: PTFE; Introduction Date: 1994-06-01; Lead Free: Lead Free; Length: 9.52mm; Lifecycle Status: Production; Clock Frequency: 18GHz; Max Operating Temperature: 165°C; Min Operating Temperature: -65°C; Mounting Technology: Edge, PCB; Pins: 1; Number of Ports: 1; Orientation: Straight; Radiation Hardening: No; REACH SVHC: No; Schedule B: 8536695050, 8536695050|8536695050|8536695050|8536695050|8536695050; Shell Material: Brass; Termination: Solder; ComponentLink1URL: https://datasheet.octopart.com:443/142-0701-801-Cinch-Connectors-datasheet-38159423.pdf?src-supplier=element14+APAC; ComponentLink1Description: https://datasheet.octopart.com:443/142-0701-801-Cinch-Connectors-datasheet-38159423.pdf?src-supplier=element14+APAC; ComponentLink2URL: https://datasheet.octopart.com:443/142-0701-801-Cinch-Connectivity-Solutions-datasheet-128878268.pdf?src-supplier=JRH+Electronics; ComponentLink2Description: https://datasheet.octopart.com:443/142-0701-801-Cinch-Connectivity-Solutions-datasheet-128878268.pdf?src-supplier=JRH+Electronics; ComponentLink3URL: https://datasheet.octopart.com:443/142-0701-801-Cinch-Connectivity-Solutions-datasheet-180501451.pdf?src-supplier=IHS; ComponentLink3Description: https://datasheet.octopart.com:443/142-0701-801-Cinch-Connectivity-Solutions-datasheet-180501451.pdf?src-supplier=IHS; ComponentLink4URL: https://datasheet.octopart.com:443/142-0701-801-Cinch-Connectivity-Solutions-datasheet-182240672.pdf?src-supplier=IHS; ComponentLink4Description: https://datasheet.octopart.com:443/142-0701-801-Cinch-Connectivity-Solutions-datasheet-182240672.pdf?src-supplier=IHS; ComponentLink5URL: https://datasheet.octopart.com:443/142-0701-801-Emerson-datasheet-182246267.pdf?src-supplier=IHS; ComponentLink5Description: https://datasheet.octopart.com:443/142-0701-801-Emerson-datasheet-182246267.pdf?src-supplier=IHS; ComponentLink6URL: https://datasheet.octopart.com:443/142-0701-801-Emerson-Network-Power-datasheet-40124.pdf?src-supplier=Newark; ComponentLink6Description: https://datasheet.octopart.com:443/142-0701-801-Emerson-Network-Power-datasheet-40124.pdf?src-supplier=Newark; ComponentLink7URL: https://datasheet.octopart.com:443/142-0701-801-Cinch-Connectors-datasheet-24914353.pdf?src-supplier=Electro+Sonic; ComponentLink7Description: https://datasheet.octopart.com:443/142-0701-801-Cinch-Connectors-datasheet-24914353.pdf?src-supplier=Electro+Sonic; ComponentLink8URL: https://datasheet.octopart.com:443/142-0701-801-Emerson-Network-Power-datasheet-14433785.pdf?src-supplier=Farnell; ComponentLink8Description: https://datasheet.octopart.com:443/142-0701-801-Emerson-Network-Power-datasheet-14433785.pdf?src-supplier=Farnell; ComponentLink9URL: https://datasheet.octopart.com:443/142-0701-801-Emerson-Network-Power-datasheet-8828422.pdf?src-supplier=Farnell; ComponentLink9Description: https://datasheet.octopart.com:443/142-0701-801-Emerson-Network-Power-datasheet-8828422.pdf?src-supplier=Farnell; ComponentLink10URL: https://datasheet.octopart.com:443/142-0701-801-Emerson-Network-Power-datasheet-10031126.pdf?src-supplier=Farnell; ComponentLink10Description: https://datasheet.octopart.com:443/142-0701-801-Emerson-Network-Power-datasheet-10031126.pdf?src-supplier=Farnell; ComponentLink11URL: https://datasheet.octopart.com:443/142-0701-801-Emerson-Network-Power-datasheet-47159.pdf?src-supplier=Farnell; ComponentLink11Description: https://datasheet.octopart.com:443/142-0701-801-Emerson-Network-Power-datasheet-47159.pdf?src-supplier=Farnell; ComponentLink12URL: https://datasheet.octopart.com:443/142-0701-801-Emerson-Network-Power-datasheet-29036.pdf?src-supplier=Farnell; ComponentLink12Description: https://datasheet.octopart.com:443/142-0701-801-Emerson-Network-Power-datasheet-29036.pdf?src-supplier=Farnell; ComponentLink13URL: https://datasheet.octopart.com:443/142-0701-801-Semflex-datasheet-33021794.pdf?src-supplier=East+Coast+Microwave; ComponentLink13Description: https://datasheet.octopart.com:443/142-0701-801-Semflex-datasheet-33021794.pdf?src-supplier=East+Coast+Microwave; ComponentLink14URL: https://datasheet.octopart.com:443/142-0701-801-Emerson-datasheet-31818286.pdf?src-supplier=East+Coast+Microwave; ComponentLink14Description: https://datasheet.octopart.com:443/142-0701-801-Emerson-datasheet-31818286.pdf?src-supplier=East+Coast+Microwave; ComponentLink15URL: https://datasheet.octopart.com:443/142-0701-801-Cinch-Connectors-datasheet-27682.pdf?src-supplier=RS+(Formerly+Allied+Electronics); ComponentLink15Description: https://datasheet.octopart.com:443/142-0701-801-Cinch-Connectors-datasheet-27682.pdf?src-supplier=RS+(Formerly+Allied+Electronics); ComponentLink16URL: https://datasheet.octopart.com:443/142-0701-801-Emerson-Network-Power-datasheet-644257.pdf?src-supplier=Future+Electronics; ComponentLink16Description: https://datasheet.octopart.com:443/142-0701-801-Emerson-Network-Power-datasheet-644257.pdf?src-supplier=Future+Electronics; ComponentLink17URL: https://datasheet.octopart.com:443/142-0701-801-Emerson-Network-Power-datasheet-55164.pdf?src-supplier=_legacy+Avnet; ComponentLink17Description: https://datasheet.octopart.com:443/142-0701-801-Emerson-Network-Power-datasheet-55164.pdf?src-supplier=_legacy+Avnet
R1-R4 = RES: 62.5mW Thin Film Resistor ±50ppm/℃ ±0.1% 50Ω 0402 Chip Resistor - Surface Mount ROHS; Manufacturer: Yageo; Manufacturer Part Number: RT0402BRE0750RL; Tolerance: +-0.1%; Power Rating: 1/16 W; Max Power Dissipation: 63mW; Temperature Coefficient: 50ppm/°C; Voltage Rating: 50V; Package Size: 0402; Supplier: DigiKey; Supplier Part Number: 13-RT0402BRE0750RLCT-ND; RoHS: Compliant; Category: Chip SMD Resistors; Stock: 104846; Pricing: 1=0.18, 10=0.076, 25=0.074, 50=0.0714, 100=0.0663, 250=0.05816, 500=0.0561, 1000=0.04564, 10000=0.05508, 20000=0.05304, 30000=0.04099, 50000=0.03992, 70000=0.03927, 100000=0.03862, 120000=0.03831, 240000=0.03778 (USD); Case/Package: 0402; China RoHS: Non-Compliant; Composition: Thin Film; Country of Origin: Mainland China; Export Control Classification Number (ECCN) Code: EAR99; Features: Moisture Resistant; Height: 350µm; Harmonized Tariff Schedule (HTS) Code: 8533.21.00.30; Introduction Date: 2017-09-12; Length: 990.6µm; Lifecycle Status: Production; Max Operating Temperature: 155°C; Min Operating Temperature: -55°C; Mounting Technology: Surface Mount; Number of Terminals: 2; Number of Terminations: 2; Packaging: Tape & Reel; Power Dissipation: 62.5mW; REACH SVHC: Yes; Value: 50Ω; Width: 508µm; Working Voltage: 50V; ComponentLink1URL: https://datasheet.octopart.com:443/RT0402BRE0750RL-Yageo-datasheet-169971040.pdf?src-supplier=Upverter; ComponentLink1Description: https://datasheet.octopart.com:443/RT0402BRE0750RL-Yageo-datasheet-169971040.pdf?src-supplier=Upverter; ComponentLink2URL: https://sigma.octopart.com:443/138820526/technical_drawing/Yageo-RT0402BRE0750RL.pdf?src-supplier=Upverter; ComponentLink2Description: https://sigma.octopart.com:443/138820526/technical_drawing/Yageo-RT0402BRE0750RL.pdf?src-supplier=Upverter; ComponentLink3URL: https://datasheet.octopart.com:443/RT0402BRE0750RL-Yageo-datasheet-96443642.pdf?src-supplier=IHS; ComponentLink3Description: https://datasheet.octopart.com:443/RT0402BRE0750RL-Yageo-datasheet-96443642.pdf?src-supplier=IHS; ComponentLink4URL: https://datasheet.octopart.com:443/RT0402BRE0750RL-Yageo-datasheet-176402239.pdf?src-supplier=Future+Electronics; ComponentLink4Description: https://datasheet.octopart.com:443/RT0402BRE0750RL-Yageo-datasheet-176402239.pdf?src-supplier=Future+Electronics; ComponentLink5URL: https://datasheet.octopart.com:443/RT0402BRE0750RL-Yageo-datasheet-166250672.pdf?src-supplier=Future+Electronics; ComponentLink5Description: https://datasheet.octopart.com:443/RT0402BRE0750RL-Yageo-datasheet-166250672.pdf?src-supplier=Future+Electronics; ComponentLink6URL: https://datasheet.octopart.com:443/RT0402BRE0750RL-Yageo-datasheet-141265893.pdf?src-supplier=ODG+(Origin+Data+Global); ComponentLink6Description: https://datasheet.octopart.com:443/RT0402BRE0750RL-Yageo-datasheet-141265893.pdf?src-supplier=ODG+(Origin+Data+Global); ComponentLink7URL: https://datasheet.octopart.com/RT0402BRE0750RL-Yageo-datasheet-86813807.pdf; ComponentLink7Description: https://datasheet.octopart.com/RT0402BRE0750RL-Yageo-datasheet-86813807.pdf; ComponentLink8URL: http://sigma.octopart.com:80/conflict_mineral_statement/Yageo-company-3.pdf?src-supplier=Compliance+Statements; ComponentLink8Description: http://sigma.octopart.com:80/conflict_mineral_statement/Yageo-company-3.pdf?src-supplier=Compliance+Statements; ComponentLink9URL: http://sigma.octopart.com:80/rohs_statement/Yageo-company-2.pdf?src-supplier=Compliance+Statements; ComponentLink9Description: http://sigma.octopart.com:80/rohs_statement/Yageo-company-2.pdf?src-supplier=Compliance+Statements
R5-R7 = RES: Res General Purpose Thick Film 0402 100K Ohm 1% 1/16W ±100ppm/°C Molded SMD Paper T/R; Manufacturer: Yageo; Manufacturer Part Number: RC0402FR-07100KL; Max Power Dissipation: 63mW; Value: 100kΩ; Voltage Rating: 50V; Tolerance: 1%; Power Rating: 1/16 W; Package Size: 0402; Supplier: DigiKey; Supplier Part Number: 311-100KLRCT-ND; RoHS: Compliant; Category: Chip SMD Resistors; Stock: 9511413; Pricing: 1=0.1, 10=0.021, 25=0.0152, 50=0.012, 100=0.0097, 250=0.0074, 500=0.00612, 1000=0.00512, 5000=0.00355, 10000=0.0031, 20000=0.00275, 30000=0.00257, 50000=0.00239, 70000=0.00228, 100000=0.00218 (USD); Case/Package: 0402; Case Code (Imperial): 0402; Case Code (Metric): 0402; China RoHS: Non-Compliant; Composition: Thick Film; Contact Plating: Tin; Depth: 500µm; Features: Moisture Resistant; Height: 350µm; Lead Free: Lead Free; Length: 1mm; Lifecycle Status: Production; Max Operating Temperature: 155°C; Military Standard: Not; Min Operating Temperature: -55°C; Mounting Technology: Surface Mount; Pins: 2; Number of Terminals: 2; Number of Terminations: 2; Packaging: Cut Tape (CT); Radiation Hardening: No; REACH SVHC: Yes; Schedule B: 8533210045, 8533210045|8533210045, 8533210045|8533210045|8533210045, 8533210045|8533210045|8533210045|8533210045; Temperature Coefficient: 100ppm/°C; Termination: SMD/SMT; Voltage Rating (AC): 50V; Voltage Rating (DC): 50V; Width: 500µm; Working Voltage: 50V; ComponentLink1URL: https://datasheet.octopart.com:443/RC0402FR-07100KL-Yageo-datasheet-175887523.pdf?src-supplier=Newark; ComponentLink1Description: https://datasheet.octopart.com:443/RC0402FR-07100KL-Yageo-datasheet-175887523.pdf?src-supplier=Newark; ComponentLink2URL: https://datasheet.octopart.com:443/RC0402FR-07100KL-Yageo-datasheet-10408619.pdf?src-supplier=Newark; ComponentLink2Description: https://datasheet.octopart.com:443/RC0402FR-07100KL-Yageo-datasheet-10408619.pdf?src-supplier=Newark; ComponentLink3URL: https://datasheet.octopart.com:443/RC0402FR-07100KL-Yageo-datasheet-8324527.pdf?src-supplier=Newark; ComponentLink3Description: https://datasheet.octopart.com:443/RC0402FR-07100KL-Yageo-datasheet-8324527.pdf?src-supplier=Newark; ComponentLink4URL: https://datasheet.octopart.com:443/RC0402FR-07100KL-Yageo-datasheet-103092701.pdf?src-supplier=Upverter; ComponentLink4Description: https://datasheet.octopart.com:443/RC0402FR-07100KL-Yageo-datasheet-103092701.pdf?src-supplier=Upverter; ComponentLink5URL: https://datasheet.octopart.com:443/RC0402FR-07100KL-Yageo-datasheet-141435361.pdf?src-supplier=Upverter; ComponentLink5Description: https://datasheet.octopart.com:443/RC0402FR-07100KL-Yageo-datasheet-141435361.pdf?src-supplier=Upverter; ComponentLink6URL: https://datasheet.octopart.com:443/RC0402FR-07100KL-Yageo-datasheet-62067350.pdf?src-supplier=Farnell; ComponentLink6Description: https://datasheet.octopart.com:443/RC0402FR-07100KL-Yageo-datasheet-62067350.pdf?src-supplier=Farnell; ComponentLink7URL: https://datasheet.octopart.com:443/RC0402FR-07100KL-Yageo-datasheet-12531192.pdf?src-supplier=Future+Electronics; ComponentLink7Description: https://datasheet.octopart.com:443/RC0402FR-07100KL-Yageo-datasheet-12531192.pdf?src-supplier=Future+Electronics; ComponentLink8URL: https://datasheet.octopart.com:443/RC0402FR-07100KL-Yageo-Group-datasheet-176638170.pdf?src-supplier=Future+Electronics; ComponentLink8Description: https://datasheet.octopart.com:443/RC0402FR-07100KL-Yageo-Group-datasheet-176638170.pdf?src-supplier=Future+Electronics; ComponentLink9URL: https://datasheet.octopart.com:443/RC0402FR-07100KL-Yageo-datasheet-164759695.pdf?src-supplier=Future+Electronics; ComponentLink9Description: https://datasheet.octopart.com:443/RC0402FR-07100KL-Yageo-datasheet-164759695.pdf?src-supplier=Future+Electronics; ComponentLink10URL: https://datasheet.octopart.com:443/RC0402FR-07100KL-Yageo-datasheet-127823281.pdf?src-supplier=Future+Electronics; ComponentLink10Description: https://datasheet.octopart.com:443/RC0402FR-07100KL-Yageo-datasheet-127823281.pdf?src-supplier=Future+Electronics; ComponentLink11URL: https://datasheet.octopart.com:443/RC0402FR-07100KL-Yageo-datasheet-137700087.pdf?src-supplier=Future+Electronics; ComponentLink11Description: https://datasheet.octopart.com:443/RC0402FR-07100KL-Yageo-datasheet-137700087.pdf?src-supplier=Future+Electronics; ComponentLink12URL: https://datasheet.octopart.com:443/RC0402FR-07100KL-Yageo-datasheet-98239111.pdf?src-supplier=Future+Electronics; ComponentLink12Description: https://datasheet.octopart.com:443/RC0402FR-07100KL-Yageo-datasheet-98239111.pdf?src-supplier=Future+Electronics; ComponentLink13URL: https://datasheet.octopart.com:443/RC0402FR-07100KL-Yageo-datasheet-77992522.pdf?src-supplier=Future+Electronics; ComponentLink13Description: https://datasheet.octopart.com:443/RC0402FR-07100KL-Yageo-datasheet-77992522.pdf?src-supplier=Future+Electronics; ComponentLink14URL: https://datasheet.octopart.com:443/RC0402FR-07100KL-Yageo-datasheet-67302840.pdf?src-supplier=Future+Electronics; ComponentLink14Description: https://datasheet.octopart.com:443/RC0402FR-07100KL-Yageo-datasheet-67302840.pdf?src-supplier=Future+Electronics; ComponentLink15URL: https://datasheet.octopart.com:443/RC0402FR-07100KL-Yageo-datasheet-8324255.pdf?src-supplier=Future+Electronics; ComponentLink15Description: https://datasheet.octopart.com:443/RC0402FR-07100KL-Yageo-datasheet-8324255.pdf?src-supplier=Future+Electronics; ComponentLink16URL: https://datasheet.octopart.com:443/RC0402FR-07100KL-Yageo-datasheet-8329306.pdf?src-supplier=element14; ComponentLink16Description: https://datasheet.octopart.com:443/RC0402FR-07100KL-Yageo-datasheet-8329306.pdf?src-supplier=element14; ComponentLink17URL: https://datasheet.octopart.com:443/RC0402FR-07100KL-Yageo-datasheet-175423674.pdf?src-supplier=SOS+electronic; ComponentLink17Description: https://datasheet.octopart.com:443/RC0402FR-07100KL-Yageo-datasheet-175423674.pdf?src-supplier=SOS+electronic; ComponentLink18URL: https://datasheet.octopart.com:443/RC0402FR-07100KL-Yageo-datasheet-148775077.pdf?src-supplier=TME; ComponentLink18Description: https://datasheet.octopart.com:443/RC0402FR-07100KL-Yageo-datasheet-148775077.pdf?src-supplier=TME; ComponentLink19URL: https://datasheet.octopart.com:443/RC0402FR-07100KL-Yageo-datasheet-79472498.pdf?src-supplier=Megastar; ComponentLink19Description: https://datasheet.octopart.com:443/RC0402FR-07100KL-Yageo-datasheet-79472498.pdf?src-supplier=Megastar; ComponentLink20URL: https://datasheet.octopart.com/RC0402FR-07100KL-Yageo-datasheet-73766026.pdf; ComponentLink20Description: https://datasheet.octopart.com/RC0402FR-07100KL-Yageo-datasheet-73766026.pdf; ComponentLink21URL: http://sigma.octopart.com:80/conflict_mineral_statement/Yageo-company-3.pdf?src-supplier=Compliance+Statements; ComponentLink21Description: http://sigma.octopart.com:80/conflict_mineral_statement/Yageo-company-3.pdf?src-supplier=Compliance+Statements; ComponentLink22URL: http://sigma.octopart.com:80/rohs_statement/Yageo-company-2.pdf?src-supplier=Compliance+Statements; ComponentLink22Description: http://sigma.octopart.com:80/rohs_statement/Yageo-company-2.pdf?src-supplier=Compliance+Statements